# Altium schematic sheet Sh_ADC-DAC_Main.SchDoc
size A4
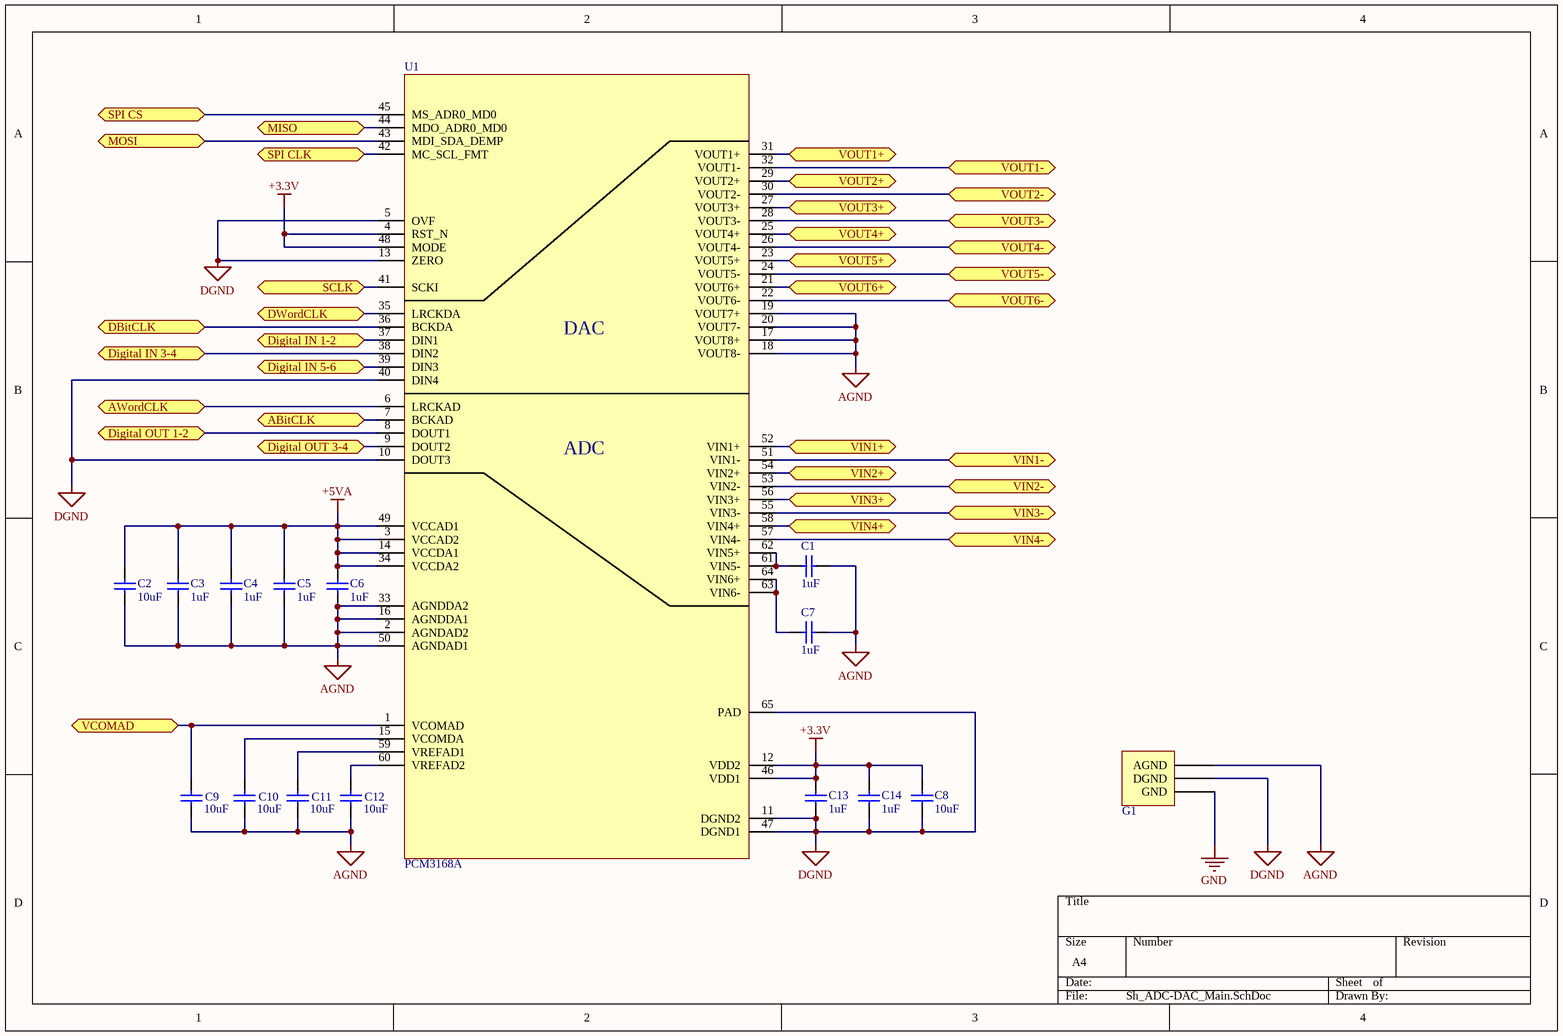
[diagram p0: Sh_ADC-DAC_Main.SchDoc]

## Parts
C1  value 1uF  [1608[0603]]  (hidden comment: Cap Semi)
C2  value 10uF  [1608[0603]]  (hidden comment: Cap Semi)
C3  value 1uF  [1608[0603]]  (hidden comment: Cap Semi)
C4  value 1uF  [1608[0603]]  (hidden comment: Cap Semi)
C5  value 1uF  [1608[0603]]  (hidden comment: Cap Semi)
C6  value 1uF  [1608[0603]]  (hidden comment: Cap Semi)
C7  value 1uF  [1608[0603]]  (hidden comment: Cap Semi)
C8  value 10uF  [1608[0603]]  (hidden comment: Cap Semi)
C9  value 10uF  [1608[0603]]  (hidden comment: Cap Semi)
C10  value 10uF  [1608[0603]]  (hidden comment: Cap Semi)
C11  value 10uF  [1608[0603]]  (hidden comment: Cap Semi)
C12  value 10uF  [1608[0603]]  (hidden comment: Cap Semi)
C13  value 1uF  [1608[0603]]  (hidden comment: Cap Semi)
C14  value 1uF  [1608[0603]]  (hidden comment: Cap Semi)
G1  Ground Connector  [GND]  (value not drawn)
U1  PCM3168A  [PAP0064J_N]

## Ports
ABitCLK, AWordCLK, DBitCLK, Digital IN 1-2, Digital IN 3-4, Digital IN 5-6, Digital OUT 1-2, Digital OUT 3-4, DWordCLK, MISO, MOSI, SCLK, SPI CLK, SPI CS, VCOMAD, VIN1+, VIN1-, VIN2+, VIN2-, VIN3+, VIN3-, VIN4+, VIN4-, VOUT1+, VOUT1-, VOUT2+, VOUT2-, VOUT3+, VOUT3-, VOUT4+, VOUT4-, VOUT5+, VOUT5-, VOUT6+, VOUT6-

## Nets
+3.3V: C8.2 C13.2 C14.2 U1.4(RST_N) U1.12(VDD2) U1.46(VDD1) U1.48(MODE)
+5VA: C2.2 C3.2 C4.2 C5.2 C6.2 U1.3(VCCAD2) U1.14(VCCDA1) U1.34(VCCDA2) U1.49(VCCAD1)
AGND: C1.1 C2.1 C3.1 C4.1 C5.1 C6.1 C7.1 C9.1 C10.1 C11.1 C12.1 G1.1(AGND) U1.2(AGNDAD2) U1.16(AGNDDA1) U1.17(VOUT8+) U1.18(VOUT8-) U1.19(VOUT7+) U1.20(VOUT7-) U1.33(AGNDDA2) U1.50(AGNDAD1)
DGND: C8.1 C13.1 C14.1 G1.2(DGND) U1.5(OVF) U1.10(DOUT3) U1.11(DGND2) U1.13(ZERO) U1.40(DIN4) U1.47(DGND1) U1.65(PAD)
GND: G1.3(GND)
ABitCLK: U1.7(BCKAD) ; port ABitCLK
AWordCLK: U1.6(LRCKAD) ; port AWordCLK
DBitCLK: U1.36(BCKDA) ; port DBitCLK
Digital IN 1-2: U1.37(DIN1) ; port Digital IN 1-2
Digital IN 3-4: U1.38(DIN2) ; port Digital IN 3-4
Digital IN 5-6: U1.39(DIN3) ; port Digital IN 5-6
Digital OUT 1-2: U1.8(DOUT1) ; port Digital OUT 1-2
Digital OUT 3-4: U1.9(DOUT2) ; port Digital OUT 3-4
DWordCLK: U1.35(LRCKDA) ; port DWordCLK
MISO: U1.44(MDO_ADR0_MD0) ; port MISO
MOSI: U1.43(MDI_SDA_DEMP) ; port MOSI
SCLK: U1.41(SCKI) ; port SCLK
SPI CLK: U1.42(MC_SCL_FMT) ; port SPI CLK
SPI CS: U1.45(MS_ADR0_MD0) ; port SPI CS
VCOMAD: C9.2 U1.1(VCOMAD) ; port VCOMAD
VIN1+: U1.52(VIN1+) ; port VIN1+
VIN1-: U1.51(VIN1-) ; port VIN1-
VIN2+: U1.54(VIN2+) ; port VIN2+
VIN2-: U1.53(VIN2-) ; port VIN2-
VIN3+: U1.56(VIN3+) ; port VIN3+
VIN3-: U1.55(VIN3-) ; port VIN3-
VIN4+: U1.58(VIN4+) ; port VIN4+
VIN4-: U1.57(VIN4-) ; port VIN4-
VOUT1+: U1.31(VOUT1+) ; port VOUT1+
VOUT1-: U1.32(VOUT1-) ; port VOUT1-
VOUT2+: U1.29(VOUT2+) ; port VOUT2+
VOUT2-: U1.30(VOUT2-) ; port VOUT2-
VOUT3+: U1.27(VOUT3+) ; port VOUT3+
VOUT3-: U1.28(VOUT3-) ; port VOUT3-
VOUT4+: U1.25(VOUT4+) ; port VOUT4+
VOUT4-: U1.26(VOUT4-) ; port VOUT4-
VOUT5+: U1.23(VOUT5+) ; port VOUT5+
VOUT5-: U1.24(VOUT5-) ; port VOUT5-
VOUT6+: U1.21(VOUT6+) ; port VOUT6+
VOUT6-: U1.22(VOUT6-) ; port VOUT6-
NetC1_2: C1.2 U1.61(VIN5-) U1.62(VIN5+)
NetC7_2: C7.2 U1.63(VIN6-) U1.64(VIN6+)
NetC10_2: C10.2 U1.15(VCOMDA)
NetC11_2: C11.2 U1.59(VREFAD1)
NetC12_2: C12.2 U1.60(VREFAD2)

## Notes on the sheet
- (in symbol PCM3168APAPR) DAC; ADC

## Library data of the parts
C1-C14 = Cap Semi: Capacitor (Semiconductor SIM Model)
G1 = GND: Ground Ultime
U1 = PCM3168APAPR: Codec Audio, 6ADC/8DAC; Value: Value